# EAGLE design Home_Automation_Nodes (EAGLE 7.6.0)
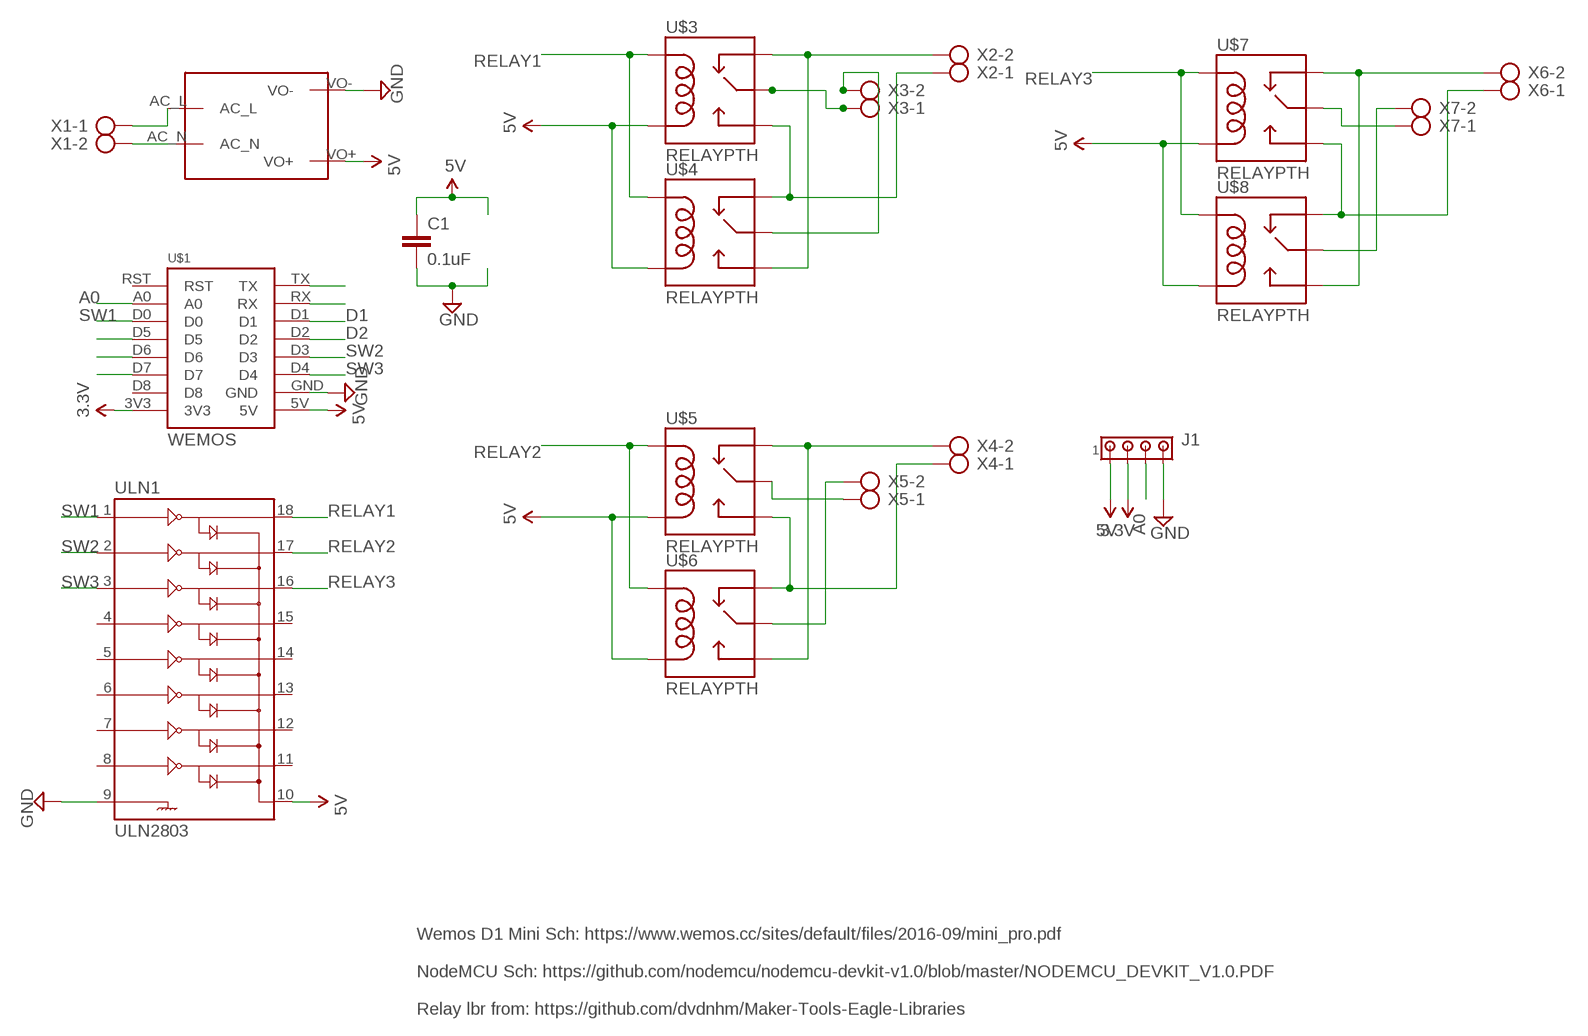
[diagram p0: schematic, sheet 1]

## Parts
C1  0.1uF  C-EU025-025X050  [C025-025X050]
J1  MTA04-100  [10X04MTA]
U$1  WEMOS  [WEMOS]
U$2  MAINS_CONVERTERS  [HLK-PM01]
U$3  RELAYPTH  [SRD-05VDC-SL-C]
U$4  RELAYPTH  [SRD-05VDC-SL-C]
U$5  RELAYPTH  [SRD-05VDC-SL-C]
U$6  RELAYPTH  [SRD-05VDC-SL-C]
U$7  RELAYPTH  [SRD-05VDC-SL-C]
U$8  RELAYPTH  [SRD-05VDC-SL-C]
ULN1  ULN2803  ULN2803DIP  [DIL18]
X1  AK300/2  [AK300/2]
X2  AK300/2  [AK300/2]
X3  AK300/2  [AK300/2]
X4  AK300/2  [AK300/2]
X5  AK300/2  [AK300/2]
X6  AK300/2  [AK300/2]
X7  AK300/2  [AK300/2]

## Nets
3.3V: J1.2 U$1.3V3
5V: C1.1 J1.1 U$1.5V U$2.VO+ U$3.COIL0 U$4.COIL0 U$5.COIL0 U$6.COIL0 U$7.COIL0 U$8.COIL0 ULN1.10
A0: J1.3 U$1.A0
D1: U$1.D1
D2: U$1.D2
D5: U$1.D5
D6: U$1.D6
D7: U$1.D7
GND: C1.2 J1.4 U$1.GND U$2.VO- ULN1.9
N$1: U$2.AC_N X1.2
N$2: U$2.AC_L X1.1
N$3: U$3.SWCOMMON X3.1
N$4: U$5.SWCOMMON X5.1
N$5: U$3.SWOPEN U$4.SWCLOSED(SWCLOSE) X2.1
N$6: U$3.SWCLOSED(SWCLOSE) U$4.SWOPEN X2.2
N$7: U$7.SWCOMMON X7.1
N$10: U$4.SWCOMMON X3.2
N$11: U$5.SWOPEN U$6.SWCLOSED(SWCLOSE) X4.1
N$12: U$5.SWCLOSED(SWCLOSE) U$6.SWOPEN X4.2
N$16: U$1.RX
N$17: U$1.TX
N$18: U$6.SWCOMMON X5.2
N$19: U$7.SWOPEN U$8.SWCLOSED(SWCLOSE) X6.1
N$20: U$7.SWCLOSED(SWCLOSE) U$8.SWOPEN X6.2
N$24: U$8.SWCOMMON X7.2
RELAY1: U$3.COIL1 U$4.COIL1 ULN1.18
RELAY2: U$5.COIL1 U$6.COIL1 ULN1.17
RELAY3: U$7.COIL1 U$8.COIL1 ULN1.16
SW1: U$1.D0 ULN1.1
SW2: U$1.D3 ULN1.2
SW3: U$1.D4 ULN1.3
Unconnected: U$1.D8 U$1.RST ULN1.4 ULN1.5 ULN1.6 ULN1.7 ULN1.8 ULN1.11 ULN1.12 ULN1.13 ULN1.14 ULN1.15

## Notes on the sheet
- Wemos D1 Mini Sch: https://www.wemos.cc/sites/default/files/2016-09/mini_pro.pdf
  
  NodeMCU Sch: https://github.com/nodemcu/nodemcu-devkit-v1.0/blob/master/NODEMCU_DEVKIT_V1.0.PDF
  
  Relay lbr from: https://github.com/dvdnhm/Maker-Tools-Eagle-Libraries

## Library data of the parts
C1 = rcl:C-EU: CAPACITOR, European symbol
J1 = con-amp:MTA04-100: AMP connector
U$1 = WeMos D1 Mini:WEMOS
U$2 = captain-slow:MAINS_CONVERTERS
U$3-U$8 = SRD-05VDC-SL-C:RELAY: SPDT relay (COM-00101)
ULN1 = SparkFun-PowerIC:ULN2803: Darlington Driver ULN2803 Darlington array. 500mA max per channel, 8-channel package. Spark Fun Electronics SKU : COM-00312
X1-X7 = con-ptr500:AK300/2: CONNECTOR; OC_FARNELL: unknown; OC_NEWARK: unknown

## Board
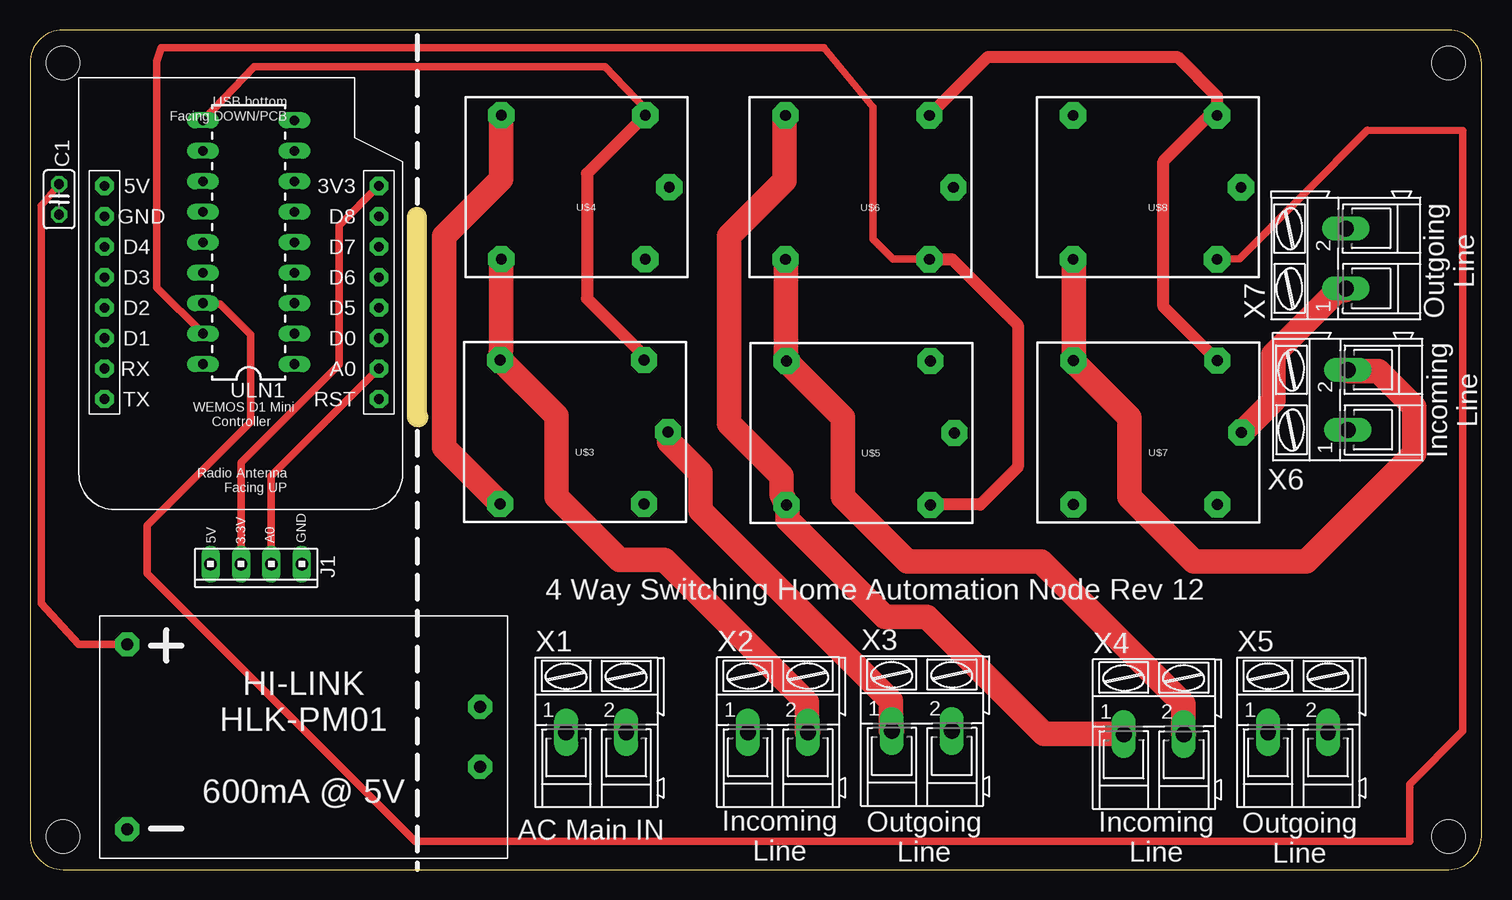
[diagram p1: board, top side]
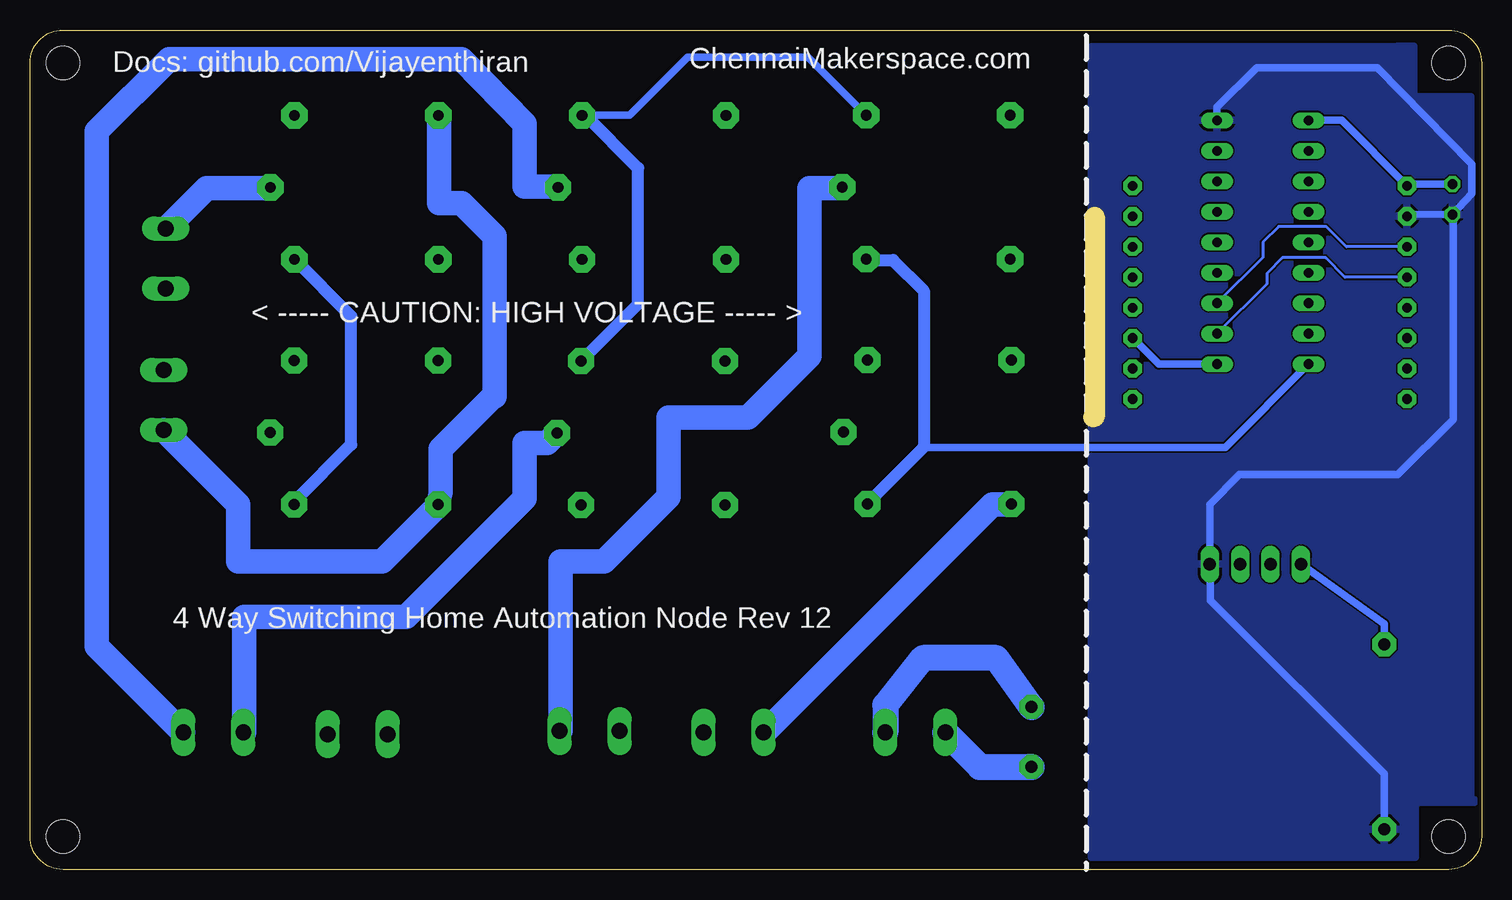
[diagram p2: board, bottom side, seen from below]

Size 121 x 70 mm. Coordinates in mm from the lower left corner, seen from the top.
Outline: 121,2.75 121,67.25 arc90 118.25,70 2.75,70 arc90 0,67.25 0,2.75 arc90 2.75,0 118.25,0 arc90 121,2.75
Copper layers (1*16): Top 0.035mm / dielectric 1.5mm / Bottom 0.035mm
Design rules "PCB_Power": minimum track width 6mil, minimum drill 10mil, track to track 6mil, track to pad 6mil, pad to pad 6mil, via to via 6mil, smd to smd 6mil, copper to edge 10mil, drill to drill 6mil, minimum pad ring 10mil, minimum via ring 10mil, stop-mask expansion 3mil, vias tented up to drill 0mil, thermal gap 10mil
Holes 2.75 mm at 2.75,2.75 118.25,2.75 118.25,67.25 2.75,67.25
Milling: 2 lines

### Footprints (pad centres in the part's own frame; a part is rotated, then mirrored left to right if it is on the bottom)
C025-025X050 = drill 0.813 octagon: 1 -1.27,0; 2 1.27,0
10X04MTA = drill 1.016 long: 1 3.81,0; 2 1.27,0; 3 -1.27,0; 4 -3.81,0
WEMOS = drill 0.8 pad 1.524 octagon: 3V3 0,0; 5V 22.86,0; A0 0,15.24; D0 0,12.7; D1 22.86,12.7; D2 22.86,10.16; D3 22.86,7.62; D4 22.86,5.08; D5 0,10.16; D6 0,7.62; D7 0,5.08; D8 0,2.54; GND 22.86,2.54; RST 0,17.78; RX 22.86,15.24; TX 22.86,17.78
HLK-PM01 = drill 1 pad 2 octagon: AC_L -14.7,2.5; AC_N -14.7,-2.5; VO+ 14.7,-7.7; VO- 14.7,7.7
SRD-05VDC-SL-C = drill 0.9 pad 2.184 octagon: COIL0 -5.39,-6.12; COIL1 -5.39,5.88; SWCLOSED 6.61,-6.12; SWCOMMON -7.39,-0.12; SWOPEN 6.61,5.88
DIL18 = drill 0.813 long: 1 -10.16,-3.81; 2 -7.62,-3.81; 3 -5.08,-3.81; 4 -2.54,-3.81; 5 0,-3.81; 6 2.54,-3.81; 7 5.08,-3.81; 8 7.62,-3.81; 9 10.16,-3.81; 10 10.16,3.81; 11 7.62,3.81; 12 5.08,3.81; 13 2.54,3.81; 14 0,3.81; 15 -2.54,3.81; 16 -5.08,3.81; 17 -7.62,3.81; 18 -10.16,3.81
AK300/2 = drill 1.321 long: 1 -2.515,0; 2 2.489,0

### Placement (x,y rotation side)
C1  2.43,55.88 270 top
J1  18.85,25.46 180 top
U$1  29.07,57.01 180 top
U$2  22.8,11.06 180 top
U$3  45.81,36.36 180 top
U$4  45.9,56.78 180 top
U$5  69.66,36.28 180 top
U$6  69.59,56.76 180 top
U$7  93.59,36.32 180 top
U$8  93.57,56.76 180 top
ULN1  18.23,52.3 90 top
X1  47.22,11.43 0 top
X2  62.36,11.45 0 top
X3  74.36,11.55 0 top
X4  93.7,11.28 0 top
X5  105.72,11.43 0 top
X6  109.85,39.17 90 top
X7  109.69,50.95 90 top

### Tracks (layer width: path | path; a pad name or v marks a point on that pad's centre or on a via)
3.3V
  Top 0.61: J1.2 17.58,33.95 25.76,42.12 25.76,53.7 U$1.3V3
5V
  Top 0.61: ULN1.10 18.69,66.93 47.95,66.93 51.29,63.39 U$4.COIL0 | U$2.VO+ 4.07,18.76 0.95,22.18 0.95,55.37 C1.1
  Top 1.016: U$4.COIL0 46.43,58.04 46.43,47.62 51.2,42.86 U$3.COIL0 | U$7.COIL0 94.49,46.94 94.49,59.05 98.31,62.88 U$8.COIL0 98.96,64.44 95.63,67.77 79.87,67.77 U$6.COIL0
  Bottom 0.61: U$4.COIL0 56.13,67.74 66.17,67.74 71.03,62.88 U$6.COIL0 | ULN1.10 11.66,62.46 U$1.5V 6.07,57.15 C1.1 | U$2.VO+ 8.1,20.48 J1.1
  Bottom 1.016: U$5.COIL0 70.31,47.15 70.31,58.5 74.69,62.88 U$6.COIL0
A0
  Top 0.61: J1.3 20.12,32.82 U$1.A0
GND
  Bottom 0.61: U$1.GND 6.04,54.64 C1.2 | U$2.VO- 8.1,7.96 22.6,22.45 22.6,25.39 J1.4 22.66,30.45 20.19,32.93 6.97,32.93 2.35,37.54 2.35,54.54 C1.2 | ULN1.9 22.04,63.56 18.73,66.87 8.67,66.87 0.82,58.83 0.82,56.37 C1.2
  pour Bottom: 7.1,68.61 32.52,68.61 32.52,1.04 5.51,1.04 5.51,5.62 0.62,5.62 0.62,5.83 0.9,5.83 0.9,64.44 5.65,64.44 5.65,68.65 7.03,68.65 7.03,68.53
N$1
  Bottom 2.184: U$2.AC_N 40.45,17.63 46.56,17.63 49.7,13.71 X1.2
N$2
  Bottom 2.184: X1.1 41.83,8.56 U$2.AC_L
N$3
  Top 2.032: X3.1 71.78,11.57 71.78,14.07 55.91,29.95 55.91,33.08 53.28,35.7 53.28,36.45 U$3.SWCOMMON
N$4
  Bottom 2.032: X5.1 103.16,11.45 103.16,21.07 89.66,21.07 79.78,30.95 79.78,35.58 77.91,35.58 77.16,36.33 U$5.SWCOMMON
N$5
  Top 2.032: U$4.SWCLOSED 39.28,62.83 39.28,57.58 34.53,52.83 34.53,35.2 39.16,30.57 U$3.SWOPEN
  Bottom 2.032: X2.1 59.78,11.45 40.78,30.45 39.28,30.45 U$3.SWOPEN
N$6
  Top 2.032: X2.2 64.78,11.45 64.78,13.95 52.91,25.82 49.16,25.82 43.91,31.07 43.91,37.83 39.28,42.45 U$3.SWCLOSED 39.28,43.45 39.28,50.83 U$4.SWOPEN
N$7
  Top 2.032: X7.1 109.66,48.33 109.03,48.33 103.66,42.95 103.66,39.08 101.03,36.45 U$7.SWCOMMON
N$10
  Bottom 2.032: X3.2 76.78,11.57 76.78,25.7 73.16,25.7 67.78,31.07 67.78,37.7 61.16,37.7 56.03,42.83 56.03,56.83 53.41,56.83 U$4.SWCOMMON
N$11
  Top 2.032: X4.1 91.16,11.32 84.53,11.32 74.78,21.07 71.28,21.07 63.16,29.2 63.16,30.32 U$5.SWOPEN 62.66,31.32 62.66,32.83 58.28,37.2 58.28,52.83 62.91,57.45 62.91,62.83 U$6.SWCLOSED
N$12
  Top 2.032: X4.2 96.16,11.32 96.16,13.82 84.28,25.7 73.16,25.7 67.78,31.07 67.78,37.7 63.16,42.33 U$5.SWCLOSED 63.03,43.33 63.03,50.83 U$6.SWOPEN
N$18
  Bottom 2.032: 115.41,18.57 115.31,18.48 | 115.31,18.48 108.28,11.45 X5.2 | U$6.SWCOMMON 77.03,56.95 79.76,56.95 79.76,62.2 85.03,67.58 109.39,67.58 115.42,61.55 115.42,18.59 115.31,18.48
N$19
  Bottom 2.032: X6.1 109.78,36.58 103.66,30.45 103.66,25.7 91.66,25.7 87.03,30.32 U$7.SWOPEN 86.78,31.45 86.78,35.08 82.41,39.45 82.28,39.45 82.28,52.83 85.03,55.58 86.91,55.58 86.91,62.83 U$8.SWCLOSED
N$20
  Top 2.032: X6.2 109.91,41.58 112.41,41.58 115.41,38.58 115.41,34.7 106.41,25.7 97.03,25.7 91.66,31.07 91.66,37.7 87.03,42.33 U$7.SWCLOSED 87.03,43.45 87.03,50.83 U$8.SWOPEN
N$24
  Bottom 2.032: X7.2 109.66,53.45 106.28,56.83 101.03,56.83 U$8.SWCOMMON
RELAY1
  Bottom 0.61: ULN1.18 21.36,35.2 46.53,35.2
  Bottom 1.016: 51.28,50.83 49.05,50.83 46.48,48.26 46.48,35.25 46.53,35.2 51.16,30.57
  Bottom 2.032: 51.16,30.57 U$3.COIL1 | 51.28,50.83 U$4.COIL1
RELAY2
  Top 0.61: ULN1.17 10.57,48.53 10.57,67.38 10.96,68.5 66.17,68.5 70.26,63.58 70.26,52.57 71.95,50.88 U$6.COIL1
  Top 1.016: U$6.COIL1 76.86,50.88 82.35,45.39 82.35,33.55 79.22,30.43 75.08,30.43 U$5.COIL1
RELAY3
  Top 0.61: U$8.COIL1 98.98,50.9 100.84,50.93 111.47,61.64 119.44,61.59 119.44,11.55 115.01,7.12 115.01,2.37 32.1,2.37 21.62,12.85 9.77,24.7 9.77,28.7 18.4,37.33 18.4,40.32 18.4,44.61 15.87,47.15 14.49,47.15 ULN1.16
  Bottom 1.016: 98.91,30.45 98.91,30.74 94.21,35.43 94.21,46.13 U$8.COIL1
  Bottom 2.032: 98.91,30.45 U$7.COIL1 | 98.91,50.83 U$8.COIL1
SW1
  Bottom 0.61: ULN1.1 26.9,42.14 U$1.D0
SW2
  Bottom 0.254: U$1.D3 11.38,49.39 13,51 16.58,51 17.89,49.7 17.89,48.83 ULN1.2
SW3
  Bottom 0.254: U$1.D4 11.25,51.93 12.95,53.62 16.9,53.62 18.23,52.3 18.23,51.03 ULN1.3

### Text on the board
tPlace: Outgoing / Line | Incoming / Line | 5V | 3.3V | A0 | GND | 4 Way Switching Home Automation Node Rev 12 | Incoming / Line | Outgoing / Line | Incoming / Line | Outgoing / Line | AC Main IN
bPlace: ChennaiMakerspace.com | Docs: github.com/Vijayenthiran | < ----- CAUTION: HIGH VOLTAGE ----- > | 4 Way Switching Home Automation Node Rev 12